# Altium schematic sheet PWR_supply_sch.SchDoc
size A; SheetNumber: 1; SheetTotal: 1
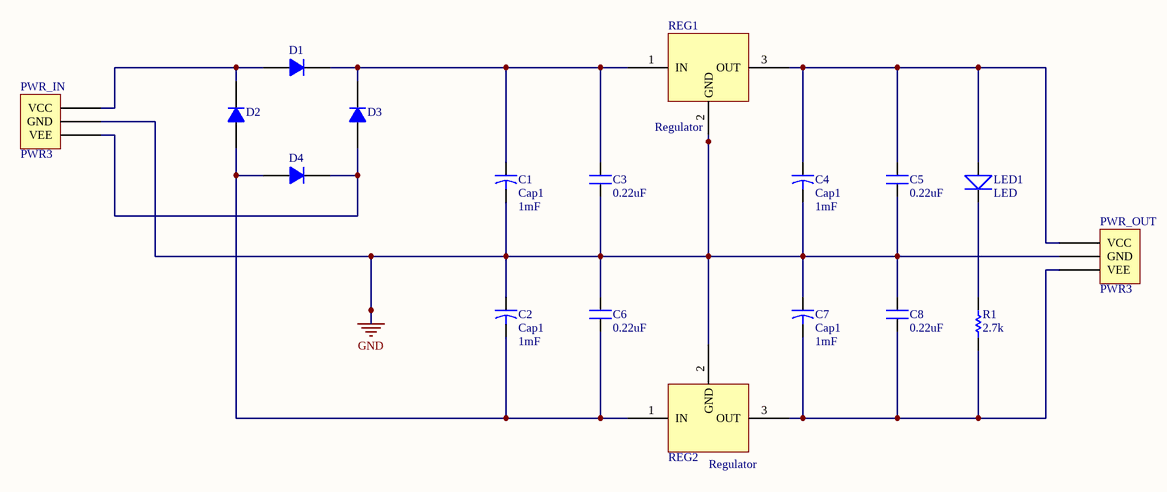
[diagram p0: PWR_supply_sch.SchDoc]

## Parts
C1  Cap1  value 1mF  [CAP1]
C2  Cap1  value 1mF  [CAP1]
C3  value 0.22uF  [CAP3]  (hidden comment: Cap3)
C4  Cap1  value 1mF  [CAP1]
C5  value 0.22uF  [CAP3]  (hidden comment: Cap3)
C6  value 0.22uF  [CAP3]  (hidden comment: Cap3)
C7  Cap1  value 1mF  [CAP1]
C8  value 0.22uF  [CAP3]  (hidden comment: Cap3)
D1  1N4007  [1N4007]  (value not drawn)
D2  1N4007  [1N4007]  (value not drawn)
D3  1N4007  [1N4007]  (value not drawn)
D4  1N4007  [1N4007]  (value not drawn)
LED1  LED  [LED]
PWR_IN  PWR3  [PWR3]
PWR_OUT  PWR3  [PWR3]
R1  value 2.7k  [RES_TOP_1]  (hidden comment: Res1)
REG1  Regulator  [Regulator]
REG2  Regulator  [Regulator]

## Nets
GND: C1.2 C2.1 C3.1 C4.2 C5.1 C6.2 C7.1 C8.2 PWR_IN.2(GND) PWR_OUT.2(GND) REG1.2(GND) REG2.2(GND)
NetC1_1: C1.1 C3.2 D1.2(K) D3.2(K) REG1.1(IN)
NetC2_2: C2.2 C6.1 D2.1(A) D4.1(A) REG2.1(IN)
NetC4_1: C4.1 C5.2 LED1.1(A) PWR_OUT.1(VCC) REG1.3(OUT)
NetC7_2: C7.2 C8.1 PWR_OUT.3(VEE) R1.1 REG2.3(OUT)
NetD1_1: D1.1(A) D2.2(K) PWR_IN.1(VCC)
NetD3_1: D3.1(A) D4.2(K) PWR_IN.3(VEE)
NetLED1_2: LED1.2(K) R1.2

## Library data of the parts
C1 C2 C4 C7 = Cap1: Capacitor; Published: 23-Sep-2002; PackageReference: CAPR5-4X5; Publisher: Altium Limited; PackageDescription: Capacitor; 2 Leads
C3 C5 C6 C8 = Cap3: Capacitor; Published: 23-Sep-2002; PackageReference: CAPR5-4X5; Publisher: Altium Limited; PackageDescription: Capacitor; 2 Leads
D1-D4 = 1N4007: 1 Amp General Purpose Rectifier; Published: 8-Jun-2000; LatestRevisionDate: 17-Jul-2002; LatestRevisionNote: Re-released for DXP Platform.; DatasheetVersion: 1998; PackageVersion: Aug-1999; PackageReference: DO-41; Publisher: Altium Limited; PackageDescription: Diode, Axial; Body 5.2 x 2.7 mm (LxDia. max), Lead Dia. 0.86 mm (max); Code_JEDEC: DO-204-AL; ComponentLink1Description: Manufacturer Link; ComponentLink1URL: http://www.fairchildsemi.com/; ComponentLink2Description: Datasheet; ComponentLink2URL: http://www.fairchildsemi.com/ds/1N%2F1N4001.pdf
R1 = Res1: Resistor; Published: 8-Jun-2000; LatestRevisionDate: 17-Jul-2002; LatestRevisionNote: Re-released for DXP Platform.; PackageReference: AXIAL-0.3; Publisher: Altium Limited; PackageDescription: Axial Device, Thru-Hole; 2 Leads; 0.3 in Pin Spacing